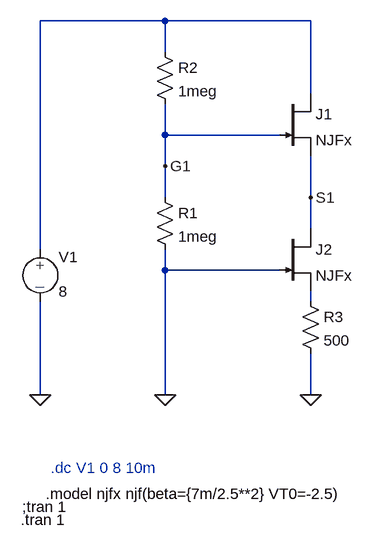
[diagram p0: schematic Draft5.asc]
Draft5.asc, the LTspice schematic file:
Version 4
SHEET 1 880 768
WIRE -352 -272 -544 -272
WIRE -128 -272 -352 -272
WIRE -352 -224 -352 -272
WIRE -128 -160 -128 -272
WIRE -352 -96 -352 -144
WIRE -176 -96 -352 -96
WIRE -352 -48 -352 -96
WIRE -352 0 -352 -48
WIRE -128 0 -128 -64
WIRE -128 48 -128 0
WIRE -544 80 -544 -272
WIRE -352 112 -352 80
WIRE -176 112 -352 112
WIRE -128 160 -128 144
WIRE -544 304 -544 160
WIRE -352 304 -352 112
WIRE -128 304 -128 240
FLAG -128 304 0
FLAG -352 304 0
FLAG -544 304 0
FLAG -128 0 S1
FLAG -352 -48 G1
SYMBOL EIT_Semiconductors\\njf -176 -160 R0
SYMATTR InstName J1
SYMATTR Value NJFx
SYMBOL EIT_Semiconductors\\njf -176 48 R0
SYMATTR InstName J2
SYMATTR Value NJFx
SYMBOL res -368 -16 R0
SYMATTR InstName R1
SYMATTR Value 1meg
SYMBOL res -368 -240 R0
SYMATTR InstName R2
SYMATTR Value 1meg
SYMBOL res -144 144 R0
SYMATTR InstName R3
SYMATTR Value 500
SYMBOL source-V -544 64 R0
WINDOW 123 0 0 Left 0
WINDOW 39 0 0 Left 0
SYMATTR InstName V1
SYMATTR Value 8
TEXT -528 416 Left 0 ;.dc V1 0 8 10m
TEXT -536 456 Left 0 !.model njfx njf(beta={7m/2.5**2} VT0=-2.5)
TEXT -572 476 Left 0 !;tran 1
TEXT -574 496 Left 0 !.tran 1

The netlist it stands for:
* Draft5.asc
J1 N001 G1 S1 NJFx
J2 S1 0 N002 NJFx
R1 G1 0 1meg
R2 N001 G1 1meg
R3 N002 0 500
V1 N001 0 8
.model NJF NJF
.model PJF PJF
.lib standard.jft
* .dc V1 0 8 10m
.model njfx njf(beta={7m/2.5**2} VT0=-2.5)
;tran 1
.tran 1
.backanno
.end